# EAGLE schematic euclidean (EAGLE 7.3.0)
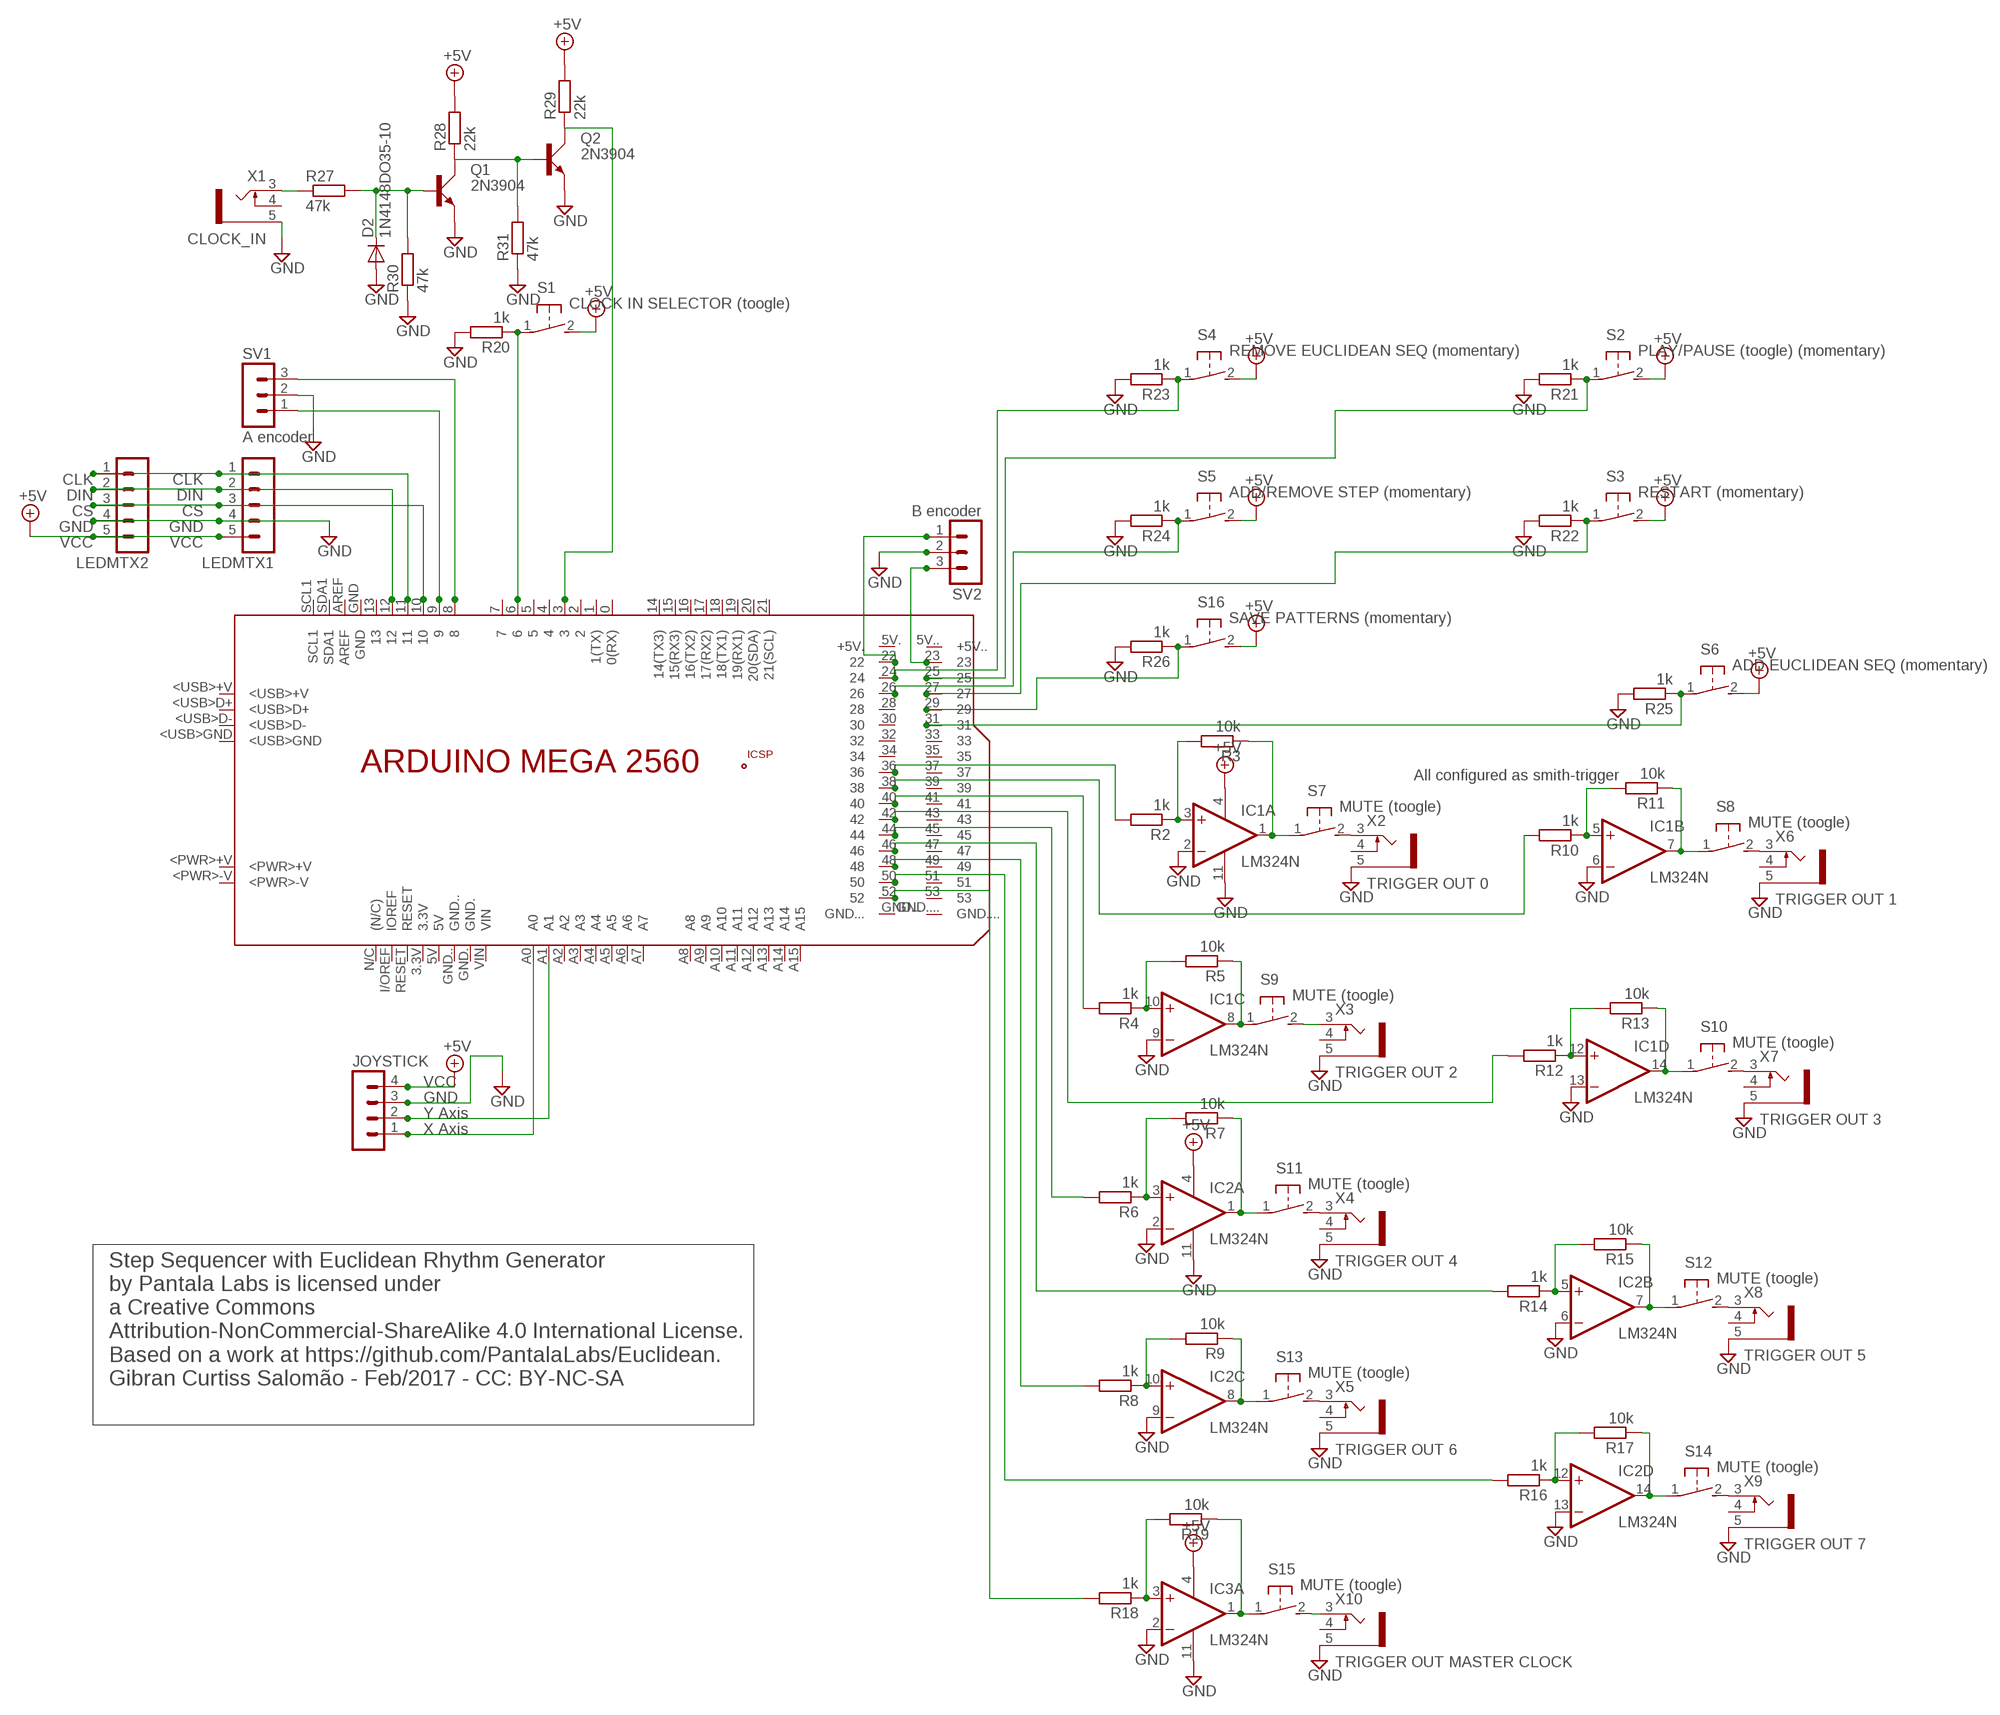
[diagram p0: schematic, sheet 1]

## Parts
D2  1N4148DO35-10  [DO35-10]
IC1  LM324N  [DIL14]
IC2  LM324N  [DIL14]
IC3  LM324N  [DIL14]
JOYSTICK  MA04-1  [MA04-1]
LEDMTX1  MA05-1  [MA05-1]
LEDMTX2  MA05-1  [MA05-1]
PCB1  ARDUINO_MEGA2560  [ARDUINO_MEGA2560]
Q1  2N3904  [TO92D]
Q2  2N3904  [TO92D]
R2  1k  R-EU_0204/7  [0204/7]
R3  10k  R-EU_0204/7  [0204/7]
R4  1k  R-EU_0204/7  [0204/7]
R5  10k  R-EU_0204/7  [0204/7]
R6  1k  R-EU_0204/7  [0204/7]
R7  10k  R-EU_0204/7  [0204/7]
R8  1k  R-EU_0204/7  [0204/7]
R9  10k  R-EU_0204/7  [0204/7]
R10  1k  R-EU_0204/7  [0204/7]
R11  10k  R-EU_0204/7  [0204/7]
R12  1k  R-EU_0204/7  [0204/7]
R13  10k  R-EU_0204/7  [0204/7]
R14  1k  R-EU_0204/7  [0204/7]
R15  10k  R-EU_0204/7  [0204/7]
R16  1k  R-EU_0204/7  [0204/7]
R17  10k  R-EU_0204/7  [0204/7]
R18  1k  R-EU_0204/7  [0204/7]
R19  10k  R-EU_0204/7  [0204/7]
R20  1k  R-EU_0204/7  [0204/7]
R21  1k  R-EU_0204/7  [0204/7]
R22  1k  R-EU_0204/7  [0204/7]
R23  1k  R-EU_0204/7  [0204/7]
R24  1k  R-EU_0204/7  [0204/7]
R25  1k  R-EU_0204/7  [0204/7]
R26  1k  R-EU_0204/7  [0204/7]
R27  47k  R-EU_0204/7  [0204/7]
R28  22k  R-EU_0204/7  [0204/7]
R29  22k  R-EU_0204/7  [0204/7]
R30  47k  R-EU_0204/7  [0204/7]
R31  47k  R-EU_0204/7  [0204/7]
S1  CLOCK IN SELECTOR (toogle)  31-XX  [B3F-31XX]
S2  PLAY/PAUSE (toogle) (momentary)  31-XX  [B3F-31XX]
S3  RESTART (momentary)  31-XX  [B3F-31XX]
S4  REMOVE EUCLIDEAN SEQ (momentary)  31-XX  [B3F-31XX]
S5  ADD/REMOVE STEP (momentary)  31-XX  [B3F-31XX]
S6  ADD EUCLIDEAN SEQ (momentary)  31-XX  [B3F-31XX]
S7  MUTE (toogle)  31-XX  [B3F-31XX]
S8  MUTE (toogle)  31-XX  [B3F-31XX]
S9  MUTE (toogle)  31-XX  [B3F-31XX]
S10  MUTE (toogle)  31-XX  [B3F-31XX]
S11  MUTE (toogle)  31-XX  [B3F-31XX]
S12  MUTE (toogle)  31-XX  [B3F-31XX]
S13  MUTE (toogle)  31-XX  [B3F-31XX]
S14  MUTE (toogle)  31-XX  [B3F-31XX]
S15  MUTE (toogle)  31-XX  [B3F-31XX]
S16  SAVE PATTERNS (momentary)  31-XX  [B3F-31XX]
SV1  A encoder  MA03-1  [MA03-1]
SV2  B encoder  MA03-1  [MA03-1]
X1  CLOCK_IN  KLBR1  [KLBR1]
X2  TRIGGER OUT 0  KLBR1  [KLBR1]
X3  TRIGGER OUT 2  KLBR1  [KLBR1]
X4  TRIGGER OUT 4  KLBR1  [KLBR1]
X5  TRIGGER OUT 6  KLBR1  [KLBR1]
X6  TRIGGER OUT 1  KLBR1  [KLBR1]
X7  TRIGGER OUT 3  KLBR1  [KLBR1]
X8  TRIGGER OUT 5  KLBR1  [KLBR1]
X9  TRIGGER OUT 7  KLBR1  [KLBR1]
X10  TRIGGER OUT MASTER CLOCK  KLBR1  [KLBR1]

## Nets
+5V: IC1.4(P:V+) IC2.4(P:V+) IC3.4(P:V+) JOYSTICK.4 LEDMTX1.5 LEDMTX2.5 R28.2 R29.2 S1.2(S) S2.2(S) S3.2(S) S4.2(S) S5.2(S) S6.2(S) S16.2(S)
GND: D2.A IC1.2(A:-IN) IC1.6(B:-IN) IC1.9(C:-IN) IC1.11(P:V-) IC1.13(D:-IN) IC2.2(A:-IN) IC2.6(B:-IN) IC2.9(C:-IN) IC2.11(P:V-) IC2.13(D:-IN) IC3.2(A:-IN) IC3.11(P:V-) JOYSTICK.3 LEDMTX1.4 LEDMTX2.4 Q1.E Q2.E R20.2 R21.2 R22.2 R23.2 R24.2 R25.2 R26.2 R30.1 R31.1 SV1.2 SV2.2 X1.5 X2.5 X3.5 X4.5 X5.5 X6.5 X7.5 X8.5 X9.5 X10.5
N$1: LEDMTX1.1 LEDMTX2.1 PCB1.11
N$2: LEDMTX1.2 LEDMTX2.2 PCB1.12
N$3: LEDMTX1.3 LEDMTX2.3 PCB1.10
N$4: IC1.3(A:+IN) R2.1 R3.2
N$5: PCB1.36 R2.2
N$6: R27.1 X1.3
N$8: JOYSTICK.2 PCB1.A1
N$9: JOYSTICK.1 PCB1.A0
N$10: IC1.1(A:OUT) R3.1 S7.1(P)
N$11: IC1.10(C:+IN) R4.1 R5.2
N$12: PCB1.38 R10.2
N$13: IC1.8(C:OUT) R5.1 S9.1(P)
N$14: IC2.3(A:+IN) R6.1 R7.2
N$15: PCB1.40 R4.2
N$16: IC2.1(A:OUT) R7.1 S11.1(P)
N$17: IC2.10(C:+IN) R8.1 R9.2
N$18: PCB1.42 R12.2
N$19: IC2.8(C:OUT) R9.1 S13.1(P)
N$20: IC1.5(B:+IN) R10.1 R11.2
N$21: PCB1.44 R6.2
N$22: IC1.7(B:OUT) R11.1 S8.1(P)
N$23: IC1.12(D:+IN) R12.1 R13.2
N$24: PCB1.46 R14.2
N$25: IC1.14(D:OUT) R13.1 S10.1(P)
N$26: IC2.5(B:+IN) R14.1 R15.2
N$27: PCB1.48 R8.2
N$28: IC2.7(B:OUT) R15.1 S12.1(P)
N$29: IC2.12(D:+IN) R16.1 R17.2
N$30: PCB1.50 R16.2
N$31: IC2.14(D:OUT) R17.1 S14.1(P)
N$32: IC3.3(A:+IN) R18.1 R19.2
N$33: PCB1.52 R18.2
N$34: IC3.1(A:OUT) R19.1 S15.1(P)
N$35: PCB1.6 R20.1 S1.1(P)
N$36: PCB1.25 R21.1 S2.1(P)
N$37: PCB1.27 R22.1 S3.1(P)
N$38: PCB1.24 R23.1 S4.1(P)
N$39: PCB1.26 R24.1 S5.1(P)
N$40: PCB1.31 R25.1 S6.1(P)
N$41: PCB1.8 SV1.3
N$42: PCB1.9 SV1.1
N$43: PCB1.22 SV2.1
N$44: PCB1.23 SV2.3
N$45: S15.2(S) X10.3
N$46: S14.2(S) X9.3
N$47: S13.2(S) X5.3
N$48: S12.2(S) X8.3
N$49: S11.2(S) X4.3
N$50: S9.2(S) X3.3
N$51: S10.2(S) X7.3
N$52: S8.2(S) X6.3
N$53: S7.2(S) X2.3
N$54: PCB1.29 R26.1 S16.1(P)
N$55: D2.C Q1.B R27.2 R30.2
N$57: Q1.C Q2.B R28.1 R31.2
N$58: PCB1.3 Q2.C R29.1
Unconnected: IC3.5(B:+IN) IC3.6(B:-IN) IC3.7(B:OUT) IC3.8(C:OUT) IC3.9(C:-IN) IC3.10(C:+IN) IC3.12(D:+IN) IC3.13(D:-IN) IC3.14(D:OUT) PCB1.0(0(RX)) PCB1.1(1(TX)) PCB1.2 PCB1.3.3V PCB1.4 PCB1.5 PCB1.5V PCB1.5V.(+5V.) PCB1.5V..(+5V..) PCB1.7 PCB1.13 PCB1.14(14(TX3)) PCB1.15(15(RX3)) PCB1.16(16(TX2)) PCB1.17(17(RX2)) PCB1.18(18(TX1)) PCB1.19(19(RX1)) PCB1.20(20(SDA)) PCB1.21(21(SCL)) PCB1.28 PCB1.30 PCB1.32 PCB1.33 PCB1.34 PCB1.35 PCB1.37 PCB1.39 PCB1.41 PCB1.43 PCB1.45 PCB1.47 PCB1.49 PCB1.51 PCB1.53 PCB1.+5V_ PCB1.<PWR>+V PCB1.<PWR>-V PCB1.<USB>+V PCB1.<USB>D+ PCB1.<USB>D- PCB1.<USB>GND PCB1.A2 PCB1.A3 PCB1.A4 PCB1.A5 PCB1.A6 PCB1.A7 PCB1.A8 PCB1.A9 PCB1.A10 PCB1.A11 PCB1.A12 PCB1.A13 PCB1.A14 PCB1.A15 PCB1.AREF PCB1.GND PCB1.GND. PCB1.GND.. PCB1.GND... PCB1.GND.... PCB1.GND__ PCB1.I/OREF(IOREF) PCB1.MISO PCB1.MOSI PCB1.N/C((N/C)) PCB1.RESET PCB1.RESET. PCB1.SCK PCB1.SCL1 PCB1.SDA1 PCB1.VIN X1.4 X2.4 X3.4 X4.4 X5.4 X6.4 X7.4 X8.4 X9.4 X10.4

## Notes on the sheet
- CLK | CLK
- DIN | DIN
- CS | CS
- GND | GND
- VCC | VCC
- All configured as smith-trigger
- VCC
- GND
- Y Axis
- X Axis
- Step Sequencer with Euclidean Rhythm Generator
  by Pantala Labs is licensed under 
  a Creative Commons 
  Attribution-NonCommercial-ShareAlike 4.0 International License. 
  Based on a work at https://github.com/PantalaLabs/Euclidean.
  Gibran Curtiss Salomão - Feb/2017 - CC: BY-NC-SA

## Library data of the parts
D2 = diode:1N4148: DIODE high speed (Philips)
IC1-IC3 = linear:LM324: OP AMP
JOYSTICK = con-lstb:MA04-1: PIN HEADER; OC_FARNELL: unknown; OC_NEWARK: unknown
LEDMTX1 LEDMTX2 = con-lstb:MA05-1: PIN HEADER; OC_FARNELL: unknown; OC_NEWARK: unknown
PCB1 = E14_Arduino_revC:ARDUINO_MEGA2560: Device for representing an Arduino Mega 2560 board with a footprint in an EAGLE design. Created by Dave Young for Element14. More EAGLE documentation at: http://www.element14.com/community/community/knode/cadsoft_eagle
Q1 Q2 = transistor-small-signal:2N3904: NPN TRANSISTOR
R2-R31 = rcl:R-EU_: RESISTOR, European symbol
S1-S16 = switch-omron:31-XX: OMRON SWITCH; MPN: B3F-3100; OC_FARNELL: 959704; OC_NEWARK: 36M3582
SV1 SV2 = con-lstb:MA03-1: PIN HEADER; OC_FARNELL: unknown; OC_NEWARK: unknown
X1-X10 = con-lumberg:KLBR?: Jack connectors according to JISC 6560, 2.5mm / 3.5 mm Klinkensteckverbinder nach JISC 6560, 2.5mm / 3,5 mm Source: http://www.lumberg.com/Produkte/PDFs/KLBR2.pdf www.lumberg.com/Produkte/PDFs/KLBR1.pdf; MPN: KLBR 1; OC_FARNELL: 1200140; OC_NEWARK: 97K2707